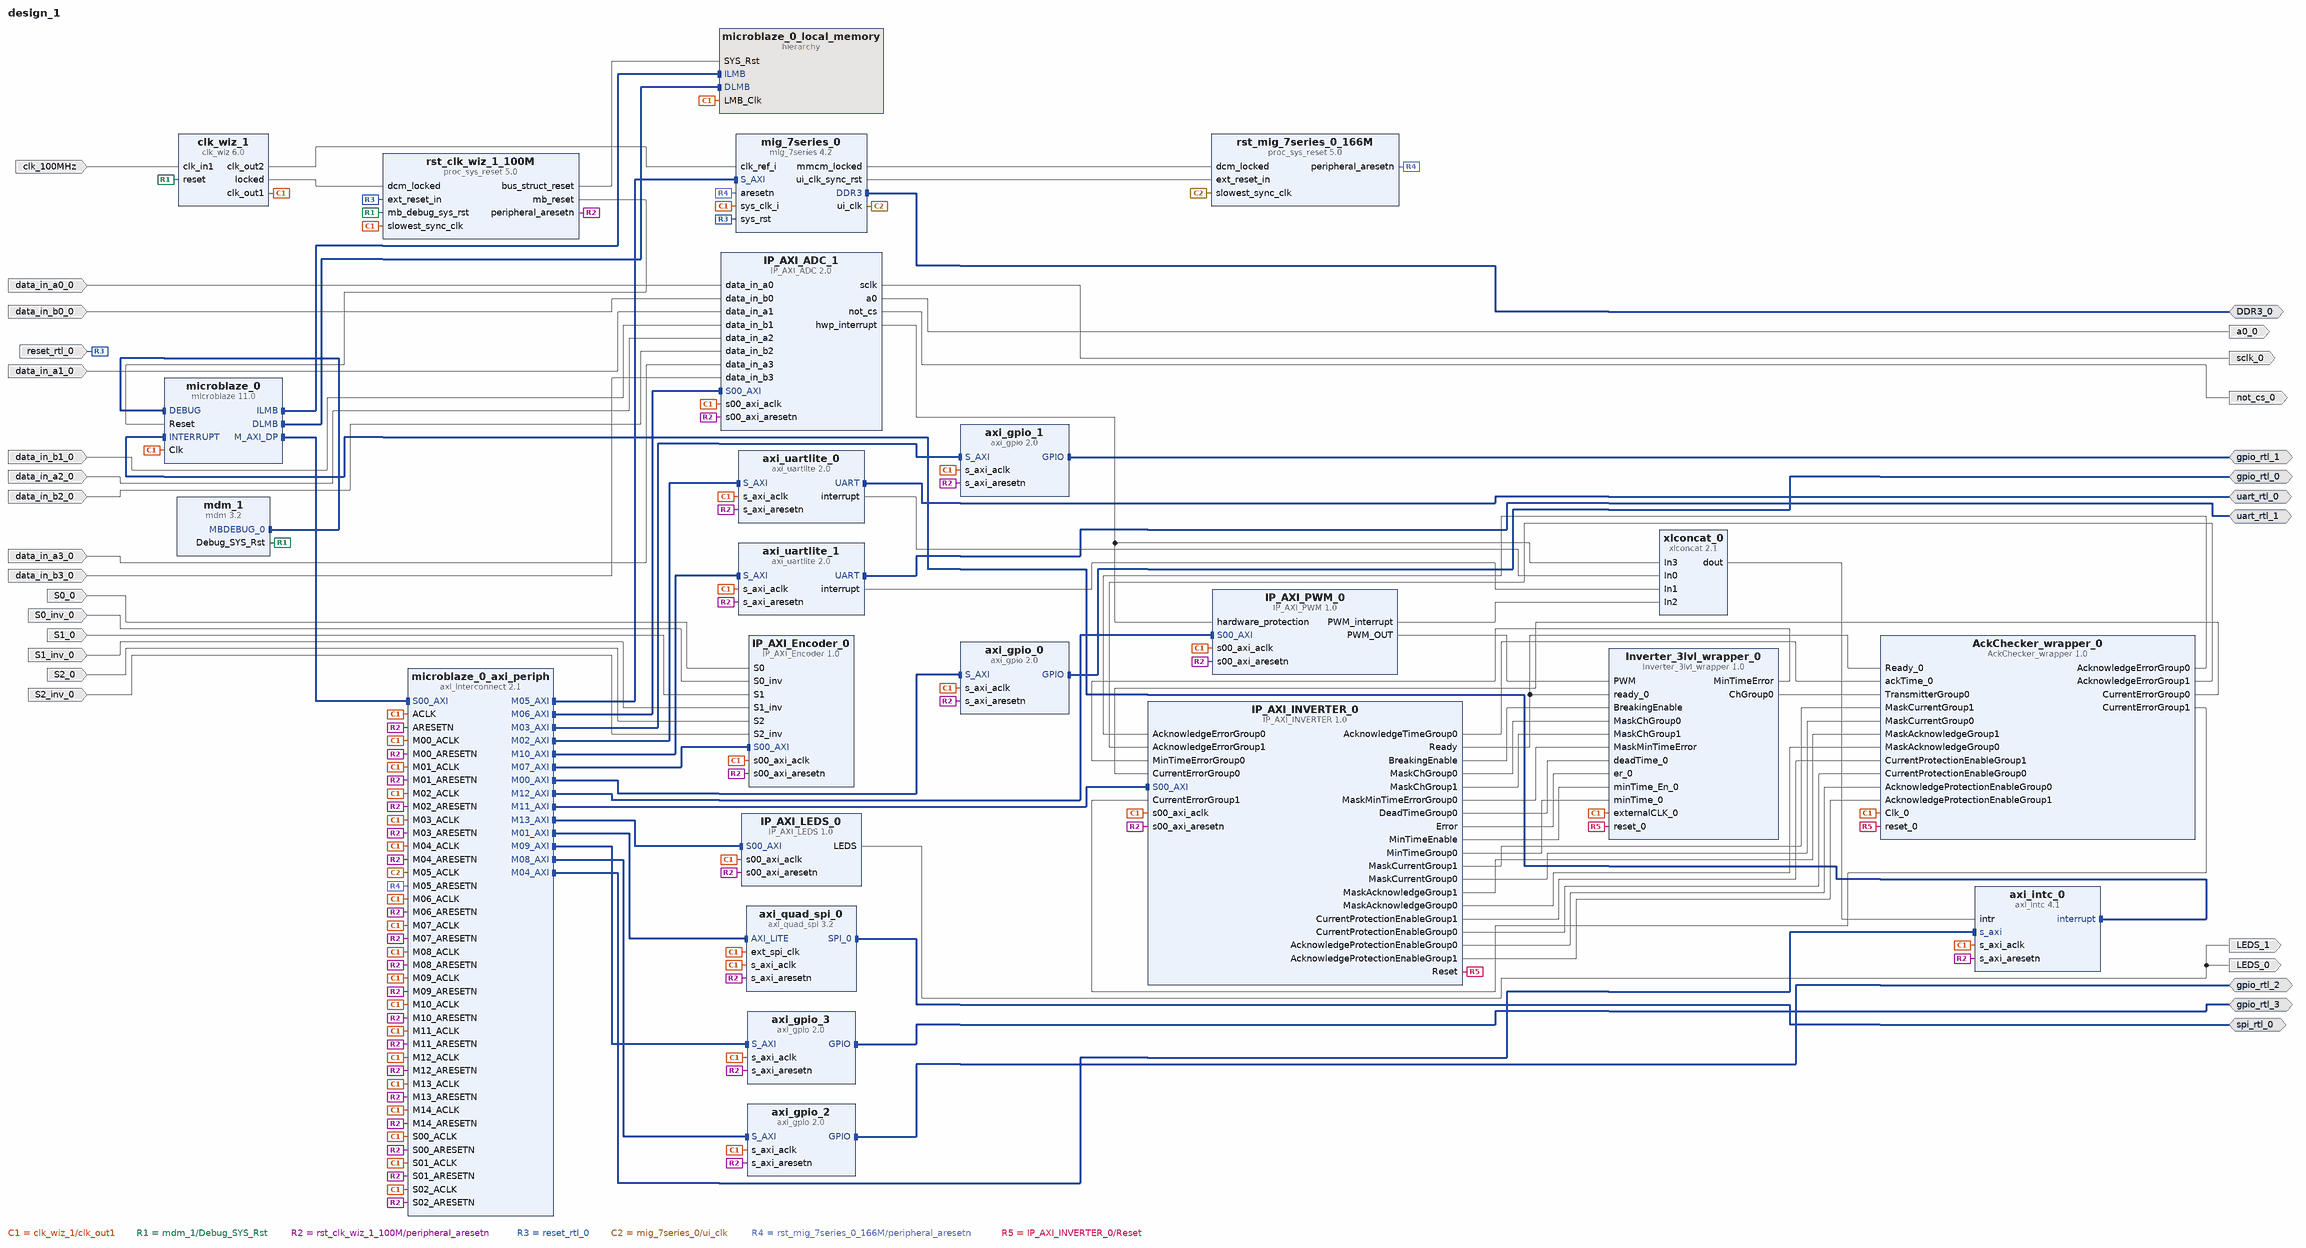
[diagram p0: block diagram of the top level]
# Vivado block design design_1, xc7a50tftg256-3, Vivado 2019.1
create_bd_design design_1

create_bd_intf_port -mode Master -vlnv xilinx.com:interface:gpio_rtl:1.0 gpio_rtl_0
create_bd_intf_port -mode Master -vlnv xilinx.com:interface:spi_rtl:1.0 spi_rtl_0
create_bd_intf_port -mode Master -vlnv xilinx.com:interface:uart_rtl:1.0 uart_rtl_0
create_bd_intf_port -mode Master -vlnv xilinx.com:interface:gpio_rtl:1.0 gpio_rtl_1
create_bd_intf_port -mode Master -vlnv xilinx.com:interface:ddrx_rtl:1.0 DDR3_0
create_bd_intf_port -mode Master -vlnv xilinx.com:interface:gpio_rtl:1.0 gpio_rtl_2
create_bd_intf_port -mode Master -vlnv xilinx.com:interface:gpio_rtl:1.0 gpio_rtl_3
create_bd_intf_port -mode Master -vlnv xilinx.com:interface:uart_rtl:1.0 uart_rtl_1
create_bd_port -dir I -type rst reset_rtl_0
set_property -dict {CONFIG.POLARITY ACTIVE_HIGH} [get_bd_ports reset_rtl_0]
create_bd_port -dir I -type clk clk_100MHz
set_property -dict {CONFIG.CLK_DOMAIN design_1_clk_100MHz CONFIG.FREQ_HZ 200000000} [get_bd_ports clk_100MHz]
create_bd_port -dir O sclk_0
create_bd_port -dir O a0_0
create_bd_port -dir O not_cs_0
create_bd_port -dir I data_in_a0_0
create_bd_port -dir I data_in_b0_0
create_bd_port -dir I data_in_a1_0
create_bd_port -dir I data_in_b1_0
create_bd_port -dir I data_in_a2_0
create_bd_port -dir I data_in_b2_0
create_bd_port -dir I data_in_a3_0
create_bd_port -dir I data_in_b3_0
create_bd_port -dir I S0_0
create_bd_port -dir I S0_inv_0
create_bd_port -dir I S1_0
create_bd_port -dir I S1_inv_0
create_bd_port -dir I S2_0
create_bd_port -dir I S2_inv_0
create_bd_port -dir O LEDS_0
create_bd_port -dir O LEDS_1

create_bd_cell -type ip -vlnv xilinx.com:ip:axi_gpio:2.0 axi_gpio_0
set_property -dict {CONFIG.C_ALL_OUTPUTS 1 CONFIG.C_DOUT_DEFAULT 0x00000000 CONFIG.C_GPIO_WIDTH 8} [get_bd_cells axi_gpio_0]
create_bd_cell -type ip -vlnv xilinx.com:ip:microblaze:11.0 microblaze_0
set_property -dict [list \
  CONFIG.C_ADDR_TAG_BITS 0 \
  CONFIG.C_DCACHE_ADDR_TAG 0 \
  CONFIG.C_DEBUG_ENABLED 1 \
  CONFIG.C_D_AXI 1 \
  CONFIG.C_D_LMB 1 \
  CONFIG.C_I_LMB 1 \
  CONFIG.C_USE_DCACHE 0 \
  CONFIG.C_USE_ICACHE 0 \
] [get_bd_cells microblaze_0]
create_bd_cell -type hier microblaze_0_local_memory
create_bd_cell -type ip -vlnv xilinx.com:ip:mdm:3.2 mdm_1
create_bd_cell -type ip -vlnv xilinx.com:ip:clk_wiz:6.0 clk_wiz_1
set_property -dict [list \
  CONFIG.CLKIN1_JITTER_PS 50.0 \
  CONFIG.CLKIN2_JITTER_PS 100.0 \
  CONFIG.CLKOUT1_DRIVES BUFG \
  CONFIG.CLKOUT1_JITTER 129.198 \
  CONFIG.CLKOUT1_PHASE_ERROR 89.971 \
  CONFIG.CLKOUT1_REQUESTED_OUT_FREQ 50.000 \
  CONFIG.CLKOUT2_DRIVES BUFG \
  CONFIG.CLKOUT2_JITTER 98.146 \
  CONFIG.CLKOUT2_PHASE_ERROR 89.971 \
  CONFIG.CLKOUT2_REQUESTED_OUT_FREQ 200.000 \
  CONFIG.CLKOUT2_USED true \
  CONFIG.CLKOUT3_DRIVES BUFG \
  CONFIG.CLKOUT4_DRIVES BUFG \
  CONFIG.CLKOUT5_DRIVES BUFG \
  CONFIG.CLKOUT6_DRIVES BUFG \
  CONFIG.CLKOUT7_DRIVES BUFG \
  CONFIG.ENABLE_CLOCK_MONITOR false \
  CONFIG.FEEDBACK_SOURCE FDBK_AUTO \
  CONFIG.MMCM_BANDWIDTH OPTIMIZED \
  CONFIG.MMCM_CLKFBOUT_MULT_F 5 \
  CONFIG.MMCM_CLKIN1_PERIOD 5.000 \
  CONFIG.MMCM_CLKIN2_PERIOD 10.0 \
  CONFIG.MMCM_CLKOUT0_DIVIDE_F 20 \
  CONFIG.MMCM_CLKOUT1_DIVIDE 5 \
  CONFIG.MMCM_COMPENSATION ZHOLD \
  CONFIG.MMCM_DIVCLK_DIVIDE 1 \
  CONFIG.NUM_OUT_CLKS 2 \
  CONFIG.PRIMITIVE PLL \
  CONFIG.PRIM_IN_FREQ 200.000 \
  CONFIG.PRIM_SOURCE Global_buffer \
  CONFIG.RESET_PORT reset \
  CONFIG.RESET_TYPE ACTIVE_HIGH \
  CONFIG.SECONDARY_IN_FREQ 100.000 \
  CONFIG.SECONDARY_SOURCE Single_ended_clock_capable_pin \
  CONFIG.USE_INCLK_SWITCHOVER false \
] [get_bd_cells clk_wiz_1]
create_bd_cell -type ip -vlnv xilinx.com:ip:proc_sys_reset:5.0 rst_clk_wiz_1_100M
create_bd_cell -type ip -vlnv xilinx.com:ip:axi_interconnect:2.1 microblaze_0_axi_periph
set_property -dict {CONFIG.NUM_MI 15 CONFIG.NUM_SI 3} [get_bd_cells microblaze_0_axi_periph]
create_bd_cell -type ip -vlnv xilinx.com:ip:axi_quad_spi:3.2 axi_quad_spi_0
set_property -dict [list \
  CONFIG.C_NUM_SS_BITS 1 \
  CONFIG.C_SPI_MEMORY 2 \
  CONFIG.C_SPI_MODE 2 \
  CONFIG.C_TYPE_OF_AXI4_INTERFACE 0 \
  CONFIG.C_USE_STARTUP 0 \
  CONFIG.C_XIP_MODE 0 \
] [get_bd_cells axi_quad_spi_0]
create_bd_cell -type ip -vlnv xilinx.com:ip:axi_uartlite:2.0 axi_uartlite_0
set_property -dict [list \
  CONFIG.C_BAUDRATE 115200 \
  CONFIG.C_ODD_PARITY 0 \
  CONFIG.C_USE_PARITY 0 \
  CONFIG.PARITY No_Parity \
] [get_bd_cells axi_uartlite_0]
create_bd_cell -type ip -vlnv xilinx.com:ip:axi_gpio:2.0 axi_gpio_1
set_property -dict {CONFIG.C_ALL_INPUTS 1 CONFIG.C_GPIO_WIDTH 8} [get_bd_cells axi_gpio_1]
create_bd_cell -type ip -vlnv xilinx.com:ip:axi_intc:4.1 axi_intc_0
set_property -dict [list \
  CONFIG.C_DISABLE_SYNCHRONIZERS 1 \
  CONFIG.C_HAS_FAST 0 \
  CONFIG.C_MB_CLK_NOT_CONNECTED 1 \
  CONFIG.C_NUM_SW_INTR 0 \
] [get_bd_cells axi_intc_0]
create_bd_cell -type ip -vlnv xilinx.com:ip:mig_7series:4.2 mig_7series_0
set_property -dict [list \
  CONFIG.BOARD_MIG_PARAM Custom \
  CONFIG.MIG_DONT_TOUCH_PARAM Custom \
  CONFIG.RESET_BOARD_INTERFACE Custom \
  CONFIG.XML_INPUT_FILE mig_a.prj \
] [get_bd_cells mig_7series_0]
create_bd_cell -type ip -vlnv xilinx.com:ip:proc_sys_reset:5.0 rst_mig_7series_0_166M
create_bd_cell -type ip -vlnv ssevendenergy.com:user:IP_AXI_Encoder:1.0 IP_AXI_Encoder_0
create_bd_cell -type ip -vlnv setcorp:user:IP_AXI_ADC:2.0 IP_AXI_ADC_1
create_bd_cell -type ip -vlnv xilinx.com:ip:axi_gpio:2.0 axi_gpio_2
set_property -dict {CONFIG.C_ALL_INPUTS 0 CONFIG.C_ALL_OUTPUTS 1 CONFIG.C_GPIO_WIDTH 8} [get_bd_cells axi_gpio_2]
create_bd_cell -type ip -vlnv xilinx.com:ip:axi_gpio:2.0 axi_gpio_3
set_property -dict {CONFIG.C_ALL_INPUTS 1 CONFIG.C_GPIO_WIDTH 2} [get_bd_cells axi_gpio_3]
create_bd_cell -type ip -vlnv xilinx.com:ip:axi_uartlite:2.0 axi_uartlite_1
set_property -dict {CONFIG.C_BAUDRATE 57600} [get_bd_cells axi_uartlite_1]
create_bd_cell -type ip -vlnv xilinx.com:ip:xlconcat:2.1 xlconcat_0
set_property -dict {CONFIG.NUM_PORTS 4} [get_bd_cells xlconcat_0]
create_bd_cell -type ip -vlnv ssevendenergy.com:user:IP_AXI_INVERTER:1.0 IP_AXI_INVERTER_0
create_bd_cell -type ip -vlnv ssevendenergy.com:user:AckChecker_wrapper:1.0 AckChecker_wrapper_0
create_bd_cell -type ip -vlnv ssevendenergy.com:user:Inverter_3lvl_wrapper:1.0 Inverter_3lvl_wrapper_0
create_bd_cell -type ip -vlnv setcorp:user:IP_AXI_PWM:1.0 IP_AXI_PWM_0
create_bd_cell -type ip -vlnv ssevendenergy.com:user:IP_AXI_LEDS:1.0 IP_AXI_LEDS_0

# ---- hierarchy /microblaze_0_local_memory ----
current_bd_instance /microblaze_0_local_memory
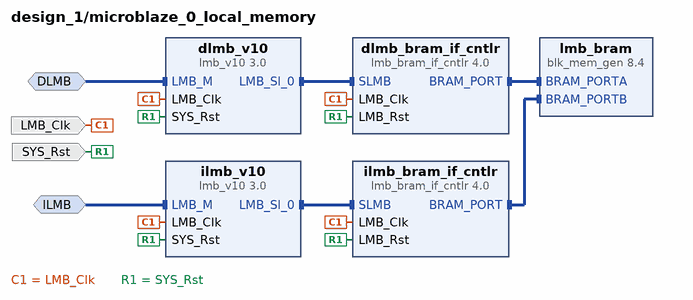
[diagram p1: block diagram inside /microblaze_0_local_memory]
create_bd_intf_pin -mode MirroredMaster -vlnv xilinx.com:interface:lmb_rtl:1.0 DLMB
create_bd_intf_pin -mode MirroredMaster -vlnv xilinx.com:interface:lmb_rtl:1.0 ILMB
create_bd_pin -dir I -type clk LMB_Clk
create_bd_pin -dir I -type rst SYS_Rst

create_bd_cell -type ip -vlnv xilinx.com:ip:lmb_v10:3.0 dlmb_v10
create_bd_cell -type ip -vlnv xilinx.com:ip:lmb_v10:3.0 ilmb_v10
create_bd_cell -type ip -vlnv xilinx.com:ip:lmb_bram_if_cntlr:4.0 dlmb_bram_if_cntlr
set_property -dict {CONFIG.C_ECC 0} [get_bd_cells dlmb_bram_if_cntlr]
create_bd_cell -type ip -vlnv xilinx.com:ip:lmb_bram_if_cntlr:4.0 ilmb_bram_if_cntlr
set_property -dict {CONFIG.C_ECC 0} [get_bd_cells ilmb_bram_if_cntlr]
create_bd_cell -type ip -vlnv xilinx.com:ip:blk_mem_gen:8.4 lmb_bram
set_property -dict {CONFIG.Memory_Type True_Dual_Port_RAM CONFIG.use_bram_block BRAM_Controller} [get_bd_cells lmb_bram]

# ---- connections ----

current_bd_instance /microblaze_0_local_memory
connect_bd_intf_net -intf_net microblaze_0_dlmb [get_bd_intf_pins DLMB] [get_bd_intf_pins dlmb_v10/LMB_M]
connect_bd_intf_net -intf_net microblaze_0_ilmb_bus [get_bd_intf_pins ilmb_v10/LMB_Sl_0] [get_bd_intf_pins ilmb_bram_if_cntlr/SLMB]
connect_bd_intf_net -intf_net microblaze_0_dlmb_cntlr [get_bd_intf_pins dlmb_bram_if_cntlr/BRAM_PORT] [get_bd_intf_pins lmb_bram/BRAM_PORTA]
connect_bd_intf_net -intf_net microblaze_0_ilmb [get_bd_intf_pins ILMB] [get_bd_intf_pins ilmb_v10/LMB_M]
connect_bd_intf_net -intf_net microblaze_0_ilmb_cntlr [get_bd_intf_pins ilmb_bram_if_cntlr/BRAM_PORT] [get_bd_intf_pins lmb_bram/BRAM_PORTB]
connect_bd_intf_net -intf_net microblaze_0_dlmb_bus [get_bd_intf_pins dlmb_v10/LMB_Sl_0] [get_bd_intf_pins dlmb_bram_if_cntlr/SLMB]
connect_bd_net -net microblaze_0_Clk [get_bd_pins LMB_Clk] \
  [get_bd_pins dlmb_v10/LMB_Clk] [get_bd_pins dlmb_bram_if_cntlr/LMB_Clk] [get_bd_pins ilmb_v10/LMB_Clk] \
  [get_bd_pins ilmb_bram_if_cntlr/LMB_Clk]
connect_bd_net [get_bd_pins SYS_Rst] \
  [get_bd_pins dlmb_v10/SYS_Rst] [get_bd_pins dlmb_bram_if_cntlr/LMB_Rst] [get_bd_pins ilmb_v10/SYS_Rst] \
  [get_bd_pins ilmb_bram_if_cntlr/LMB_Rst]
set_property HDL_ATTRIBUTE.BMM_INFO_ADDRESS_SPACE {byte  0x00000000 32 > design_1 microblaze_0_local_memory/lmb_bram} [get_bd_cells dlmb_bram_if_cntlr]
set_property HDL_ATTRIBUTE.KEEP_HIERARCHY yes [get_bd_cells dlmb_bram_if_cntlr]

current_bd_instance /
connect_bd_intf_net [get_bd_intf_pins microblaze_0_axi_periph/M08_AXI] [get_bd_intf_pins axi_gpio_2/S_AXI]
connect_bd_intf_net [get_bd_intf_ports spi_rtl_0] [get_bd_intf_pins axi_quad_spi_0/SPI_0]
connect_bd_intf_net [get_bd_intf_pins microblaze_0/M_AXI_DP] [get_bd_intf_pins microblaze_0_axi_periph/S00_AXI]
connect_bd_intf_net [get_bd_intf_pins microblaze_0/ILMB] [get_bd_intf_pins microblaze_0_local_memory/ILMB]
connect_bd_intf_net [get_bd_intf_pins microblaze_0_axi_periph/M12_AXI] [get_bd_intf_pins IP_AXI_PWM_0/S00_AXI]
connect_bd_intf_net [get_bd_intf_pins microblaze_0/DLMB] [get_bd_intf_pins microblaze_0_local_memory/DLMB]
connect_bd_intf_net [get_bd_intf_ports gpio_rtl_1] [get_bd_intf_pins axi_gpio_1/GPIO]
connect_bd_intf_net [get_bd_intf_ports gpio_rtl_2] [get_bd_intf_pins axi_gpio_2/GPIO]
connect_bd_intf_net [get_bd_intf_pins mdm_1/MBDEBUG_0] [get_bd_intf_pins microblaze_0/DEBUG]
connect_bd_intf_net [get_bd_intf_pins microblaze_0_axi_periph/M00_AXI] [get_bd_intf_pins axi_gpio_0/S_AXI]
connect_bd_intf_net [get_bd_intf_pins microblaze_0_axi_periph/M07_AXI] [get_bd_intf_pins IP_AXI_Encoder_0/S00_AXI]
connect_bd_intf_net [get_bd_intf_pins microblaze_0_axi_periph/M05_AXI] [get_bd_intf_pins mig_7series_0/S_AXI]
connect_bd_intf_net [get_bd_intf_ports gpio_rtl_3] [get_bd_intf_pins axi_gpio_3/GPIO]
connect_bd_intf_net [get_bd_intf_ports gpio_rtl_0] [get_bd_intf_pins axi_gpio_0/GPIO]
connect_bd_intf_net [get_bd_intf_pins microblaze_0_axi_periph/M03_AXI] [get_bd_intf_pins axi_gpio_1/S_AXI]
connect_bd_intf_net [get_bd_intf_pins microblaze_0_axi_periph/M09_AXI] [get_bd_intf_pins axi_gpio_3/S_AXI]
connect_bd_intf_net [get_bd_intf_pins microblaze_0_axi_periph/M06_AXI] [get_bd_intf_pins IP_AXI_ADC_1/S00_AXI]
connect_bd_intf_net [get_bd_intf_pins microblaze_0_axi_periph/M11_AXI] [get_bd_intf_pins IP_AXI_INVERTER_0/S00_AXI]
connect_bd_intf_net [get_bd_intf_pins microblaze_0_axi_periph/M02_AXI] [get_bd_intf_pins axi_uartlite_0/S_AXI]
connect_bd_intf_net [get_bd_intf_ports DDR3_0] [get_bd_intf_pins mig_7series_0/DDR3]
connect_bd_intf_net [get_bd_intf_pins microblaze_0_axi_periph/M10_AXI] [get_bd_intf_pins axi_uartlite_1/S_AXI]
connect_bd_intf_net [get_bd_intf_pins microblaze_0_axi_periph/M13_AXI] [get_bd_intf_pins IP_AXI_LEDS_0/S00_AXI]
connect_bd_intf_net [get_bd_intf_ports uart_rtl_0] [get_bd_intf_pins axi_uartlite_0/UART]
connect_bd_intf_net [get_bd_intf_pins microblaze_0_axi_periph/M04_AXI] [get_bd_intf_pins axi_intc_0/s_axi]
connect_bd_intf_net [get_bd_intf_pins microblaze_0_axi_periph/M01_AXI] [get_bd_intf_pins axi_quad_spi_0/AXI_LITE]
connect_bd_intf_net [get_bd_intf_ports uart_rtl_1] [get_bd_intf_pins axi_uartlite_1/UART]
connect_bd_intf_net [get_bd_intf_pins axi_intc_0/interrupt] [get_bd_intf_pins microblaze_0/INTERRUPT]
connect_bd_net -net microblaze_0_Clk [get_bd_pins clk_wiz_1/clk_out1] \
  [get_bd_pins microblaze_0/Clk] [get_bd_pins microblaze_0_local_memory/LMB_Clk] \
  [get_bd_pins rst_clk_wiz_1_100M/slowest_sync_clk] [get_bd_pins microblaze_0_axi_periph/S00_ACLK] \
  [get_bd_pins axi_gpio_0/s_axi_aclk] [get_bd_pins microblaze_0_axi_periph/M00_ACLK] \
  [get_bd_pins microblaze_0_axi_periph/ACLK] [get_bd_pins microblaze_0_axi_periph/S01_ACLK] \
  [get_bd_pins microblaze_0_axi_periph/S02_ACLK] [get_bd_pins axi_quad_spi_0/s_axi_aclk] \
  [get_bd_pins microblaze_0_axi_periph/M01_ACLK] [get_bd_pins axi_quad_spi_0/ext_spi_clk] \
  [get_bd_pins axi_uartlite_0/s_axi_aclk] [get_bd_pins microblaze_0_axi_periph/M02_ACLK] [get_bd_pins axi_gpio_1/s_axi_aclk] \
  [get_bd_pins microblaze_0_axi_periph/M03_ACLK] [get_bd_pins axi_intc_0/s_axi_aclk] \
  [get_bd_pins microblaze_0_axi_periph/M04_ACLK] [get_bd_pins mig_7series_0/sys_clk_i] \
  [get_bd_pins microblaze_0_axi_periph/M06_ACLK] [get_bd_pins IP_AXI_Encoder_0/s00_axi_aclk] \
  [get_bd_pins microblaze_0_axi_periph/M07_ACLK] [get_bd_pins IP_AXI_ADC_1/s00_axi_aclk] [get_bd_pins axi_gpio_2/s_axi_aclk] \
  [get_bd_pins microblaze_0_axi_periph/M08_ACLK] [get_bd_pins axi_gpio_3/s_axi_aclk] \
  [get_bd_pins microblaze_0_axi_periph/M09_ACLK] [get_bd_pins axi_uartlite_1/s_axi_aclk] \
  [get_bd_pins microblaze_0_axi_periph/M10_ACLK] [get_bd_pins IP_AXI_INVERTER_0/s00_axi_aclk] \
  [get_bd_pins microblaze_0_axi_periph/M11_ACLK] [get_bd_pins IP_AXI_PWM_0/s00_axi_aclk] \
  [get_bd_pins microblaze_0_axi_periph/M12_ACLK] [get_bd_pins Inverter_3lvl_wrapper_0/externalCLK_0] \
  [get_bd_pins AckChecker_wrapper_0/Clk_0] [get_bd_pins IP_AXI_LEDS_0/s00_axi_aclk] \
  [get_bd_pins microblaze_0_axi_periph/M13_ACLK] [get_bd_pins microblaze_0_axi_periph/M14_ACLK]
connect_bd_net [get_bd_pins clk_wiz_1/locked] [get_bd_pins rst_clk_wiz_1_100M/dcm_locked]
connect_bd_net [get_bd_pins rst_clk_wiz_1_100M/mb_reset] [get_bd_pins microblaze_0/Reset]
connect_bd_net [get_bd_pins rst_clk_wiz_1_100M/bus_struct_reset] [get_bd_pins microblaze_0_local_memory/SYS_Rst]
connect_bd_net [get_bd_pins mdm_1/Debug_SYS_Rst] [get_bd_pins rst_clk_wiz_1_100M/mb_debug_sys_rst] [get_bd_pins clk_wiz_1/reset]
connect_bd_net [get_bd_pins rst_clk_wiz_1_100M/peripheral_aresetn] \
  [get_bd_pins microblaze_0_axi_periph/S00_ARESETN] [get_bd_pins axi_gpio_0/s_axi_aresetn] \
  [get_bd_pins microblaze_0_axi_periph/M00_ARESETN] [get_bd_pins microblaze_0_axi_periph/ARESETN] \
  [get_bd_pins microblaze_0_axi_periph/S01_ARESETN] [get_bd_pins microblaze_0_axi_periph/S02_ARESETN] \
  [get_bd_pins axi_quad_spi_0/s_axi_aresetn] [get_bd_pins microblaze_0_axi_periph/M01_ARESETN] \
  [get_bd_pins axi_uartlite_0/s_axi_aresetn] [get_bd_pins microblaze_0_axi_periph/M02_ARESETN] \
  [get_bd_pins axi_gpio_1/s_axi_aresetn] [get_bd_pins microblaze_0_axi_periph/M03_ARESETN] \
  [get_bd_pins axi_intc_0/s_axi_aresetn] [get_bd_pins microblaze_0_axi_periph/M04_ARESETN] \
  [get_bd_pins microblaze_0_axi_periph/M06_ARESETN] [get_bd_pins IP_AXI_Encoder_0/s00_axi_aresetn] \
  [get_bd_pins microblaze_0_axi_periph/M07_ARESETN] [get_bd_pins IP_AXI_ADC_1/s00_axi_aresetn] \
  [get_bd_pins axi_gpio_2/s_axi_aresetn] [get_bd_pins microblaze_0_axi_periph/M08_ARESETN] \
  [get_bd_pins axi_gpio_3/s_axi_aresetn] [get_bd_pins microblaze_0_axi_periph/M09_ARESETN] \
  [get_bd_pins axi_uartlite_1/s_axi_aresetn] [get_bd_pins microblaze_0_axi_periph/M10_ARESETN] \
  [get_bd_pins IP_AXI_INVERTER_0/s00_axi_aresetn] [get_bd_pins microblaze_0_axi_periph/M11_ARESETN] \
  [get_bd_pins IP_AXI_PWM_0/s00_axi_aresetn] [get_bd_pins microblaze_0_axi_periph/M12_ARESETN] \
  [get_bd_pins IP_AXI_LEDS_0/s00_axi_aresetn] [get_bd_pins microblaze_0_axi_periph/M13_ARESETN] \
  [get_bd_pins microblaze_0_axi_periph/M14_ARESETN]
connect_bd_net -net reset_rtl_0_1 [get_bd_ports reset_rtl_0] [get_bd_pins rst_clk_wiz_1_100M/ext_reset_in] [get_bd_pins mig_7series_0/sys_rst]
connect_bd_net [get_bd_ports clk_100MHz] [get_bd_pins clk_wiz_1/clk_in1]
connect_bd_net [get_bd_pins mig_7series_0/ui_clk] [get_bd_pins microblaze_0_axi_periph/M05_ACLK] [get_bd_pins rst_mig_7series_0_166M/slowest_sync_clk]
connect_bd_net [get_bd_pins mig_7series_0/mmcm_locked] [get_bd_pins rst_mig_7series_0_166M/dcm_locked]
connect_bd_net [get_bd_pins mig_7series_0/ui_clk_sync_rst] [get_bd_pins rst_mig_7series_0_166M/ext_reset_in]
connect_bd_net [get_bd_pins rst_mig_7series_0_166M/peripheral_aresetn] \
  [get_bd_pins mig_7series_0/aresetn] [get_bd_pins microblaze_0_axi_periph/M05_ARESETN]
connect_bd_net [get_bd_pins clk_wiz_1/clk_out2] [get_bd_pins mig_7series_0/clk_ref_i]
connect_bd_net [get_bd_pins IP_AXI_ADC_1/sclk] [get_bd_ports sclk_0]
connect_bd_net [get_bd_pins IP_AXI_ADC_1/a0] [get_bd_ports a0_0]
connect_bd_net [get_bd_pins IP_AXI_ADC_1/not_cs] [get_bd_ports not_cs_0]
connect_bd_net -net data_in_a0_0_1 [get_bd_ports data_in_a0_0] [get_bd_pins IP_AXI_ADC_1/data_in_a0]
connect_bd_net -net data_in_b0_0_1 [get_bd_ports data_in_b0_0] [get_bd_pins IP_AXI_ADC_1/data_in_b0]
connect_bd_net -net data_in_a1_0_1 [get_bd_ports data_in_a1_0] [get_bd_pins IP_AXI_ADC_1/data_in_a1]
connect_bd_net -net data_in_b1_0_1 [get_bd_ports data_in_b1_0] [get_bd_pins IP_AXI_ADC_1/data_in_b1]
connect_bd_net -net data_in_a2_0_1 [get_bd_ports data_in_a2_0] [get_bd_pins IP_AXI_ADC_1/data_in_a2]
connect_bd_net -net data_in_b2_0_1 [get_bd_ports data_in_b2_0] [get_bd_pins IP_AXI_ADC_1/data_in_b2]
connect_bd_net -net data_in_a3_0_1 [get_bd_ports data_in_a3_0] [get_bd_pins IP_AXI_ADC_1/data_in_a3]
connect_bd_net -net data_in_b3_0_1 [get_bd_ports data_in_b3_0] [get_bd_pins IP_AXI_ADC_1/data_in_b3]
connect_bd_net -net S0_0_1 [get_bd_ports S0_0] [get_bd_pins IP_AXI_Encoder_0/S0]
connect_bd_net -net S0_inv_0_1 [get_bd_ports S0_inv_0] [get_bd_pins IP_AXI_Encoder_0/S0_inv]
connect_bd_net -net S1_0_1 [get_bd_ports S1_0] [get_bd_pins IP_AXI_Encoder_0/S1]
connect_bd_net -net S1_inv_0_1 [get_bd_ports S1_inv_0] [get_bd_pins IP_AXI_Encoder_0/S1_inv]
connect_bd_net -net S2_0_1 [get_bd_ports S2_0] [get_bd_pins IP_AXI_Encoder_0/S2]
connect_bd_net -net S2_inv_0_1 [get_bd_ports S2_inv_0] [get_bd_pins IP_AXI_Encoder_0/S2_inv]
connect_bd_net [get_bd_pins xlconcat_0/dout] [get_bd_pins axi_intc_0/intr]
connect_bd_net [get_bd_pins axi_uartlite_0/interrupt] [get_bd_pins xlconcat_0/In0]
connect_bd_net [get_bd_pins axi_uartlite_1/interrupt] [get_bd_pins xlconcat_0/In1]
connect_bd_net [get_bd_pins Inverter_3lvl_wrapper_0/MinTimeError] [get_bd_pins IP_AXI_INVERTER_0/MinTimeErrorGroup0]
connect_bd_net [get_bd_pins AckChecker_wrapper_0/AcknowledgeErrorGroup0] [get_bd_pins IP_AXI_INVERTER_0/AcknowledgeErrorGroup0]
connect_bd_net [get_bd_pins AckChecker_wrapper_0/AcknowledgeErrorGroup1] [get_bd_pins IP_AXI_INVERTER_0/AcknowledgeErrorGroup1]
connect_bd_net [get_bd_pins AckChecker_wrapper_0/CurrentErrorGroup0] [get_bd_pins IP_AXI_INVERTER_0/CurrentErrorGroup0]
connect_bd_net [get_bd_pins AckChecker_wrapper_0/CurrentErrorGroup1] [get_bd_pins IP_AXI_INVERTER_0/CurrentErrorGroup1]
connect_bd_net [get_bd_pins IP_AXI_INVERTER_0/BreakingEnable] [get_bd_pins Inverter_3lvl_wrapper_0/BreakingEnable]
connect_bd_net [get_bd_pins IP_AXI_INVERTER_0/MaskChGroup0] [get_bd_pins Inverter_3lvl_wrapper_0/MaskChGroup0]
connect_bd_net [get_bd_pins IP_AXI_INVERTER_0/MaskChGroup1] [get_bd_pins Inverter_3lvl_wrapper_0/MaskChGroup1]
connect_bd_net [get_bd_pins IP_AXI_INVERTER_0/MaskMinTimeErrorGroup0] [get_bd_pins Inverter_3lvl_wrapper_0/MaskMinTimeError]
connect_bd_net [get_bd_pins IP_AXI_PWM_0/PWM_interrupt] [get_bd_pins xlconcat_0/In2]
connect_bd_net [get_bd_pins IP_AXI_ADC_1/hwp_interrupt] [get_bd_pins IP_AXI_PWM_0/hardware_protection] [get_bd_pins xlconcat_0/In3]
connect_bd_net [get_bd_pins IP_AXI_PWM_0/PWM_OUT] [get_bd_pins Inverter_3lvl_wrapper_0/PWM]
connect_bd_net [get_bd_pins Inverter_3lvl_wrapper_0/ChGroup0] [get_bd_pins AckChecker_wrapper_0/TransmitterGroup0]
connect_bd_net [get_bd_pins IP_AXI_INVERTER_0/DeadTimeGroup0] [get_bd_pins Inverter_3lvl_wrapper_0/deadTime_0]
connect_bd_net [get_bd_pins IP_AXI_INVERTER_0/Error] [get_bd_pins Inverter_3lvl_wrapper_0/er_0]
connect_bd_net [get_bd_pins IP_AXI_INVERTER_0/MinTimeEnable] [get_bd_pins Inverter_3lvl_wrapper_0/minTime_En_0]
connect_bd_net [get_bd_pins IP_AXI_INVERTER_0/MinTimeGroup0] [get_bd_pins Inverter_3lvl_wrapper_0/minTime_0]
connect_bd_net [get_bd_pins IP_AXI_INVERTER_0/Ready] [get_bd_pins Inverter_3lvl_wrapper_0/ready_0] [get_bd_pins AckChecker_wrapper_0/Ready_0]
connect_bd_net [get_bd_pins IP_AXI_INVERTER_0/Reset] [get_bd_pins Inverter_3lvl_wrapper_0/reset_0] [get_bd_pins AckChecker_wrapper_0/reset_0]
connect_bd_net [get_bd_pins IP_AXI_INVERTER_0/AcknowledgeTimeGroup0] [get_bd_pins AckChecker_wrapper_0/ackTime_0]
connect_bd_net [get_bd_pins IP_AXI_INVERTER_0/MaskCurrentGroup1] [get_bd_pins AckChecker_wrapper_0/MaskCurrentGroup1]
connect_bd_net [get_bd_pins IP_AXI_INVERTER_0/MaskCurrentGroup0] [get_bd_pins AckChecker_wrapper_0/MaskCurrentGroup0]
connect_bd_net [get_bd_pins IP_AXI_INVERTER_0/MaskAcknowledgeGroup1] [get_bd_pins AckChecker_wrapper_0/MaskAcknowledgeGroup1]
connect_bd_net [get_bd_pins IP_AXI_INVERTER_0/MaskAcknowledgeGroup0] [get_bd_pins AckChecker_wrapper_0/MaskAcknowledgeGroup0]
connect_bd_net [get_bd_pins IP_AXI_INVERTER_0/CurrentProtectionEnableGroup1] [get_bd_pins AckChecker_wrapper_0/CurrentProtectionEnableGroup1]
connect_bd_net [get_bd_pins IP_AXI_INVERTER_0/CurrentProtectionEnableGroup0] [get_bd_pins AckChecker_wrapper_0/CurrentProtectionEnableGroup0]
connect_bd_net [get_bd_pins IP_AXI_INVERTER_0/AcknowledgeProtectionEnableGroup0] [get_bd_pins AckChecker_wrapper_0/AcknowledgeProtectionEnableGroup0]
connect_bd_net [get_bd_pins IP_AXI_INVERTER_0/AcknowledgeProtectionEnableGroup1] [get_bd_pins AckChecker_wrapper_0/AcknowledgeProtectionEnableGroup1]
connect_bd_net [get_bd_pins IP_AXI_LEDS_0/LEDS] [get_bd_ports LEDS_0] [get_bd_ports LEDS_1]
set_property HDL_ATTRIBUTE.BMM_INFO_PROCESSOR {microblaze-le > design_1 microblaze_0_local_memory/dlmb_bram_if_cntlr} [get_bd_cells microblaze_0]
set_property HDL_ATTRIBUTE.KEEP_HIERARCHY yes [get_bd_cells microblaze_0]

# ---- address map ----
assign_bd_address -offset 0x00000000 -range 64K -target_address_space [get_bd_addr_spaces microblaze_0/Data] [get_bd_addr_segs microblaze_0_local_memory/dlmb_bram_if_cntlr/SLMB/Mem]
assign_bd_address -offset 0x40000000 -range 64K -target_address_space [get_bd_addr_spaces microblaze_0/Data] [get_bd_addr_segs axi_gpio_0/S_AXI/Reg]
assign_bd_address -offset 0x40010000 -range 64K -target_address_space [get_bd_addr_spaces microblaze_0/Data] [get_bd_addr_segs axi_gpio_1/S_AXI/Reg]
assign_bd_address -offset 0x40020000 -range 64K -target_address_space [get_bd_addr_spaces microblaze_0/Data] [get_bd_addr_segs axi_gpio_2/S_AXI/Reg]
assign_bd_address -offset 0x40030000 -range 64K -target_address_space [get_bd_addr_spaces microblaze_0/Data] [get_bd_addr_segs axi_gpio_3/S_AXI/Reg]
assign_bd_address -offset 0x40600000 -range 64K -target_address_space [get_bd_addr_spaces microblaze_0/Data] [get_bd_addr_segs axi_uartlite_0/S_AXI/Reg]
assign_bd_address -offset 0x40610000 -range 64K -target_address_space [get_bd_addr_spaces microblaze_0/Data] [get_bd_addr_segs axi_uartlite_1/S_AXI/Reg]
assign_bd_address -offset 0x41200000 -range 64K -target_address_space [get_bd_addr_spaces microblaze_0/Data] [get_bd_addr_segs axi_intc_0/S_AXI/Reg]
assign_bd_address -offset 0x44A00000 -range 64K -target_address_space [get_bd_addr_spaces microblaze_0/Data] [get_bd_addr_segs axi_quad_spi_0/AXI_LITE/Reg]
assign_bd_address -offset 0x44A10000 -range 64K -target_address_space [get_bd_addr_spaces microblaze_0/Data] [get_bd_addr_segs IP_AXI_ADC_1/S00_AXI/S00_AXI_reg]
assign_bd_address -offset 0x44A20000 -range 64K -target_address_space [get_bd_addr_spaces microblaze_0/Data] [get_bd_addr_segs IP_AXI_Encoder_0/S00_AXI/S00_AXI_reg]
assign_bd_address -offset 0x44A30000 -range 64K -target_address_space [get_bd_addr_spaces microblaze_0/Data] [get_bd_addr_segs IP_AXI_INVERTER_0/S00_AXI/S00_AXI_reg]
assign_bd_address -offset 0x44A40000 -range 64K -target_address_space [get_bd_addr_spaces microblaze_0/Data] [get_bd_addr_segs IP_AXI_PWM_0/S00_AXI/S00_AXI_reg]
assign_bd_address -offset 0x44A50000 -range 64K -target_address_space [get_bd_addr_spaces microblaze_0/Data] [get_bd_addr_segs IP_AXI_LEDS_0/S00_AXI/S00_AXI_reg]
assign_bd_address -offset 0x80000000 -range 256M -target_address_space [get_bd_addr_spaces microblaze_0/Data] [get_bd_addr_segs mig_7series_0/memmap/memaddr]
assign_bd_address -offset 0x00000000 -range 64K -target_address_space [get_bd_addr_spaces microblaze_0/Instruction] [get_bd_addr_segs microblaze_0_local_memory/ilmb_bram_if_cntlr/SLMB/Mem]

validate_bd_design
save_bd_design
